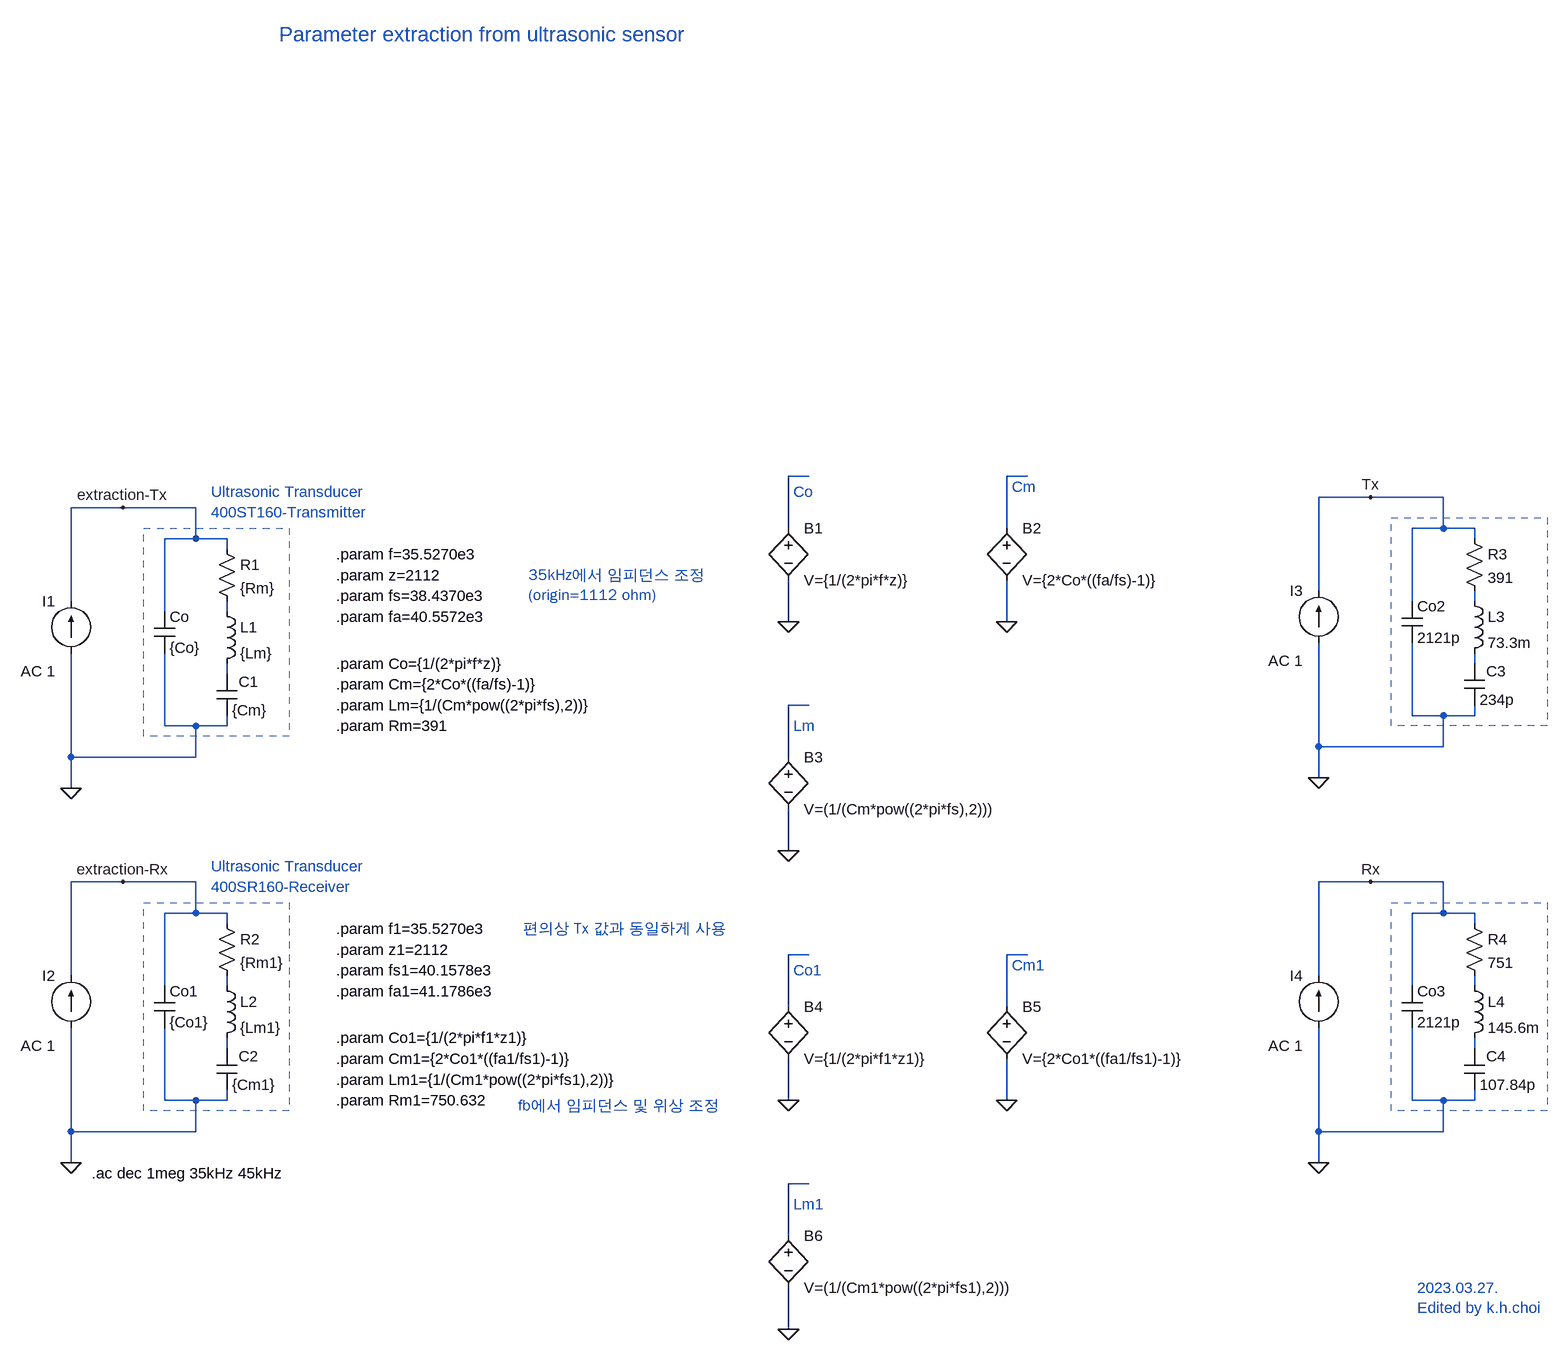
[diagram p0: schematic Parameter extraction from sensor-2.asc]
Parameter extraction from sensor-2.asc, the LTspice schematic file:
Version 4
SHEET 1 2624 1860
WIRE 976 528 944 528
WIRE 1312 528 1280 528
WIRE 1840 560 1760 560
WIRE 1952 560 1840 560
WIRE -80 576 -160 576
WIRE 32 576 -80 576
WIRE 944 608 944 528
WIRE 1280 608 1280 528
WIRE 1952 608 1952 560
WIRE 1952 608 1904 608
WIRE 2000 608 1952 608
WIRE 32 624 32 576
WIRE 32 624 -16 624
WIRE 80 624 32 624
WIRE 2000 624 2000 608
WIRE 80 640 80 624
WIRE 1760 704 1760 560
WIRE -160 720 -160 576
WIRE 1904 720 1904 608
WIRE 2000 720 2000 704
WIRE -16 736 -16 624
WIRE 80 736 80 720
WIRE 944 752 944 688
WIRE 1280 752 1280 688
WIRE 2000 816 2000 800
WIRE 80 832 80 816
WIRE 976 880 944 880
WIRE 1904 896 1904 784
WIRE 1952 896 1904 896
WIRE 2000 896 2000 880
WIRE 2000 896 1952 896
WIRE -16 912 -16 800
WIRE 32 912 -16 912
WIRE 80 912 80 896
WIRE 80 912 32 912
WIRE 1760 944 1760 784
WIRE 1952 944 1952 896
WIRE 1952 944 1760 944
WIRE -160 960 -160 800
WIRE 32 960 32 912
WIRE 32 960 -160 960
WIRE 944 960 944 880
WIRE 1760 992 1760 944
WIRE -160 1008 -160 960
WIRE 944 1104 944 1040
WIRE -80 1152 -160 1152
WIRE 32 1152 -80 1152
WIRE 1840 1152 1760 1152
WIRE 1952 1152 1840 1152
WIRE 32 1200 32 1152
WIRE 32 1200 -16 1200
WIRE 80 1200 32 1200
WIRE 1952 1200 1952 1152
WIRE 1952 1200 1904 1200
WIRE 2000 1200 1952 1200
WIRE 80 1216 80 1200
WIRE 2000 1216 2000 1200
WIRE 976 1264 944 1264
WIRE 1312 1264 1280 1264
WIRE -160 1296 -160 1152
WIRE 1760 1296 1760 1152
WIRE -16 1312 -16 1200
WIRE 80 1312 80 1296
WIRE 1904 1312 1904 1200
WIRE 2000 1312 2000 1296
WIRE 944 1344 944 1264
WIRE 1280 1344 1280 1264
WIRE 80 1408 80 1392
WIRE 2000 1408 2000 1392
WIRE -16 1488 -16 1376
WIRE 32 1488 -16 1488
WIRE 80 1488 80 1472
WIRE 80 1488 32 1488
WIRE 944 1488 944 1424
WIRE 1280 1488 1280 1424
WIRE 1904 1488 1904 1376
WIRE 1952 1488 1904 1488
WIRE 2000 1488 2000 1472
WIRE 2000 1488 1952 1488
WIRE -160 1536 -160 1376
WIRE 32 1536 32 1488
WIRE 32 1536 -160 1536
WIRE 1760 1536 1760 1376
WIRE 1952 1536 1952 1488
WIRE 1952 1536 1760 1536
WIRE -160 1584 -160 1536
WIRE 1760 1584 1760 1536
WIRE 976 1616 944 1616
WIRE 944 1696 944 1616
WIRE 944 1840 944 1776
FLAG -160 1008 0
FLAG 944 752 0
FLAG 1280 752 0
FLAG 944 1104 0
FLAG -80 576 extraction-Tx
FLAG -160 1584 0
FLAG -80 1152 extraction-Rx
FLAG 1760 992 0
FLAG 1840 560 Tx
FLAG 944 1488 0
FLAG 1280 1488 0
FLAG 944 1840 0
FLAG 1760 1584 0
FLAG 1840 1152 Rx
DATAFLAG 944 528 ""
DATAFLAG 1280 528 ""
DATAFLAG 944 880 ""
DATAFLAG 944 1264 ""
DATAFLAG 1280 1264 ""
DATAFLAG 944 1616 ""
SYMBOL res 64 624 R0
SYMATTR InstName R1
SYMATTR Value {Rm}
SYMBOL ind 64 720 R0
SYMATTR InstName L1
SYMATTR Value {Lm}
SYMBOL cap 64 832 R0
WINDOW 0 34 12 Left 2
SYMATTR InstName C1
SYMATTR Value {Cm}
SYMBOL cap -32 736 R0
SYMATTR InstName Co
SYMATTR Value {Co}
SYMBOL current -160 800 R180
WINDOW 0 24 80 Left 2
WINDOW 3 24 0 Left 2
WINDOW 123 24 -28 Left 2
WINDOW 39 0 0 Left 0
SYMATTR InstName I1
SYMATTR Value ""
SYMATTR Value2 AC 1
SYMBOL bv 944 592 R0
SYMATTR InstName B1
SYMATTR Value V={1/(2*pi*f*z)}
SYMBOL bv 1280 592 R0
SYMATTR InstName B2
SYMATTR Value V={2*Co*((fa/fs)-1)}
SYMBOL bv 944 944 R0
SYMATTR InstName B3
SYMATTR Value V=(1/(Cm*pow((2*pi*fs),2)))
SYMBOL res 64 1200 R0
SYMATTR InstName R2
SYMATTR Value {Rm1}
SYMBOL ind 64 1296 R0
SYMATTR InstName L2
SYMATTR Value {Lm1}
SYMBOL cap 64 1408 R0
WINDOW 0 34 12 Left 2
SYMATTR InstName C2
SYMATTR Value {Cm1}
SYMBOL cap -32 1312 R0
SYMATTR InstName Co1
SYMATTR Value {Co1}
SYMBOL current -160 1376 R180
WINDOW 0 24 80 Left 2
WINDOW 3 24 0 Left 2
WINDOW 123 24 -28 Left 2
WINDOW 39 0 0 Left 0
SYMATTR InstName I2
SYMATTR Value ""
SYMATTR Value2 AC 1
SYMBOL res 1984 608 R0
SYMATTR InstName R3
SYMATTR Value 391
SYMBOL ind 1984 704 R0
SYMATTR InstName L3
SYMATTR Value 73.3m
SYMBOL cap 1984 816 R0
WINDOW 0 34 12 Left 2
SYMATTR InstName C3
SYMATTR Value 234p
SYMBOL cap 1888 720 R0
SYMATTR InstName Co2
SYMATTR Value 2121p
SYMBOL current 1760 784 R180
WINDOW 0 24 80 Left 2
WINDOW 3 24 0 Left 2
WINDOW 123 24 -28 Left 2
WINDOW 39 0 0 Left 0
SYMATTR InstName I3
SYMATTR Value ""
SYMATTR Value2 AC 1
SYMBOL bv 944 1328 R0
SYMATTR InstName B4
SYMATTR Value V={1/(2*pi*f1*z1)}
SYMBOL bv 1280 1328 R0
SYMATTR InstName B5
SYMATTR Value V={2*Co1*((fa1/fs1)-1)}
SYMBOL bv 944 1680 R0
SYMATTR InstName B6
SYMATTR Value V=(1/(Cm1*pow((2*pi*fs1),2)))
SYMBOL res 1984 1200 R0
SYMATTR InstName R4
SYMATTR Value 751
SYMBOL ind 1984 1296 R0
SYMATTR InstName L4
SYMATTR Value 145.6m
SYMBOL cap 1984 1408 R0
WINDOW 0 34 12 Left 2
SYMATTR InstName C4
SYMATTR Value 107.84p
SYMBOL cap 1888 1312 R0
SYMATTR InstName Co3
SYMATTR Value 2121p
SYMBOL current 1760 1376 R180
WINDOW 0 24 80 Left 2
WINDOW 3 24 0 Left 2
WINDOW 123 24 -28 Left 2
WINDOW 39 0 0 Left 0
SYMATTR InstName I4
SYMATTR Value ""
SYMATTR Value2 AC 1
TEXT 248 816 Left 2 !.param Co={1/(2*pi*f*z)}
TEXT 248 648 Left 2 !.param f=35.5270e3
TEXT 248 680 Left 2 !.param z=2112
TEXT 248 912 Left 2 !.param Rm=391
TEXT 248 848 Left 2 !.param Cm={2*Co*((fa/fs)-1)}
TEXT 248 712 Left 2 !.param fs=38.4370e3
TEXT 248 744 Left 2 !.param fa=40.5572e3
TEXT 248 880 Left 2 !.param Lm={1/(Cm*pow((2*pi*fs),2))}
TEXT 160 -152 Left 3 ;Parameter extraction from ultrasonic sensor
TEXT 56 552 Left 2 ;Ultrasonic Transducer\n400ST160-Transmitter
TEXT -128 1600 Left 2 !.ac dec 1meg 35kHz 45kHz
TEXT 248 1392 Left 2 !.param Co1={1/(2*pi*f1*z1)}
TEXT 248 1224 Left 2 !.param f1=35.5270e3
TEXT 248 1256 Left 2 !.param z1=2112
TEXT 248 1488 Left 2 !.param Rm1=750.632
TEXT 248 1424 Left 2 !.param Cm1={2*Co1*((fa1/fs1)-1)}
TEXT 248 1288 Left 2 !.param fs1=40.1578e3
TEXT 248 1320 Left 2 !.param fa1=41.1786e3
TEXT 248 1456 Left 2 !.param Lm1={1/(Cm1*pow((2*pi*fs1),2))}
TEXT 56 1128 Left 2 ;Ultrasonic Transducer\n400SR160-Receiver
TEXT 528 1496 Left 2 ;fb에서 임피던스 및 위상 조정
TEXT 544 680 Left 2 ;35kHz에서 임피던스 조정\n(origin=1112 ohm)
TEXT 1288 544 Left 2 ;Cm
TEXT 952 552 Left 2 ;Co
TEXT 952 912 Left 2 ;Lm
TEXT 1288 1280 Left 2 ;Cm1
TEXT 952 1288 Left 2 ;Co1
TEXT 952 1648 Left 2 ;Lm1
TEXT 1912 1776 Left 2 ;2023.03.27.\nEdited by k.h.choi
TEXT 536 1224 Left 2 ;편의상 Tx 값과 동일하게 사용
RECTANGLE Normal 176 928 -48 608 2
RECTANGLE Normal 176 1504 -48 1184 2
RECTANGLE Normal 2112 912 1872 592 2
RECTANGLE Normal 2112 1504 1872 1184 2

The netlist it stands for:
* Parameter extraction from sensor-2.asc
R1 extraction-Tx N004 {Rm}
L1 N004 N006 {Lm}
C1 N006 0 {Cm}
Co extraction-Tx 0 {Co}
I1 0 extraction-Tx AC 1
B1 N001 0 V={1/(2*pi*f*z)}
B2 N002 0 V={2*Co*((fa/fs)-1)}
B3 N007 0 V=(1/(Cm*pow((2*pi*fs),2)))
R2 extraction-Rx N010 {Rm1}
L2 N010 N012 {Lm1}
C2 N012 0 {Cm1}
Co1 extraction-Rx 0 {Co1}
I2 0 extraction-Rx AC 1
R3 Tx N003 391
L3 N003 N005 73.3m
C3 N005 0 234p
Co2 Tx 0 2121p
I3 0 Tx AC 1
B4 N008 0 V={1/(2*pi*f1*z1)}
B5 N009 0 V={2*Co1*((fa1/fs1)-1)}
B6 N014 0 V=(1/(Cm1*pow((2*pi*fs1),2)))
R4 Rx N011 751
L4 N011 N013 145.6m
C4 N013 0 107.84p
Co3 Rx 0 2121p
I4 0 Rx AC 1
.param Co={1/(2*pi*f*z)}
.param f=35.5270e3
.param z=2112
.param Rm=391
.param Cm={2*Co*((fa/fs)-1)}
.param fs=38.4370e3
.param fa=40.5572e3
.param Lm={1/(Cm*pow((2*pi*fs),2))}
* Parameter extraction from ultrasonic sensor
* Ultrasonic Transducer
* 400ST160-Transmitter
.ac dec 1meg 35kHz 45kHz
.param Co1={1/(2*pi*f1*z1)}
.param f1=35.5270e3
.param z1=2112
.param Rm1=750.632
.param Cm1={2*Co1*((fa1/fs1)-1)}
.param fs1=40.1578e3
.param fa1=41.1786e3
.param Lm1={1/(Cm1*pow((2*pi*fs1),2))}
* Ultrasonic Transducer
* 400SR160-Receiver
* fb에서 임피던스 및 위상 조정
* 35kHz에서 임피던스 조정
* (origin=1112 ohm)
* Cm
* Co
* Lm
* Cm1
* Co1
* Lm1
* 2023.03.27.
* Edited by k.h.choi
* 편의상 Tx 값과 동일하게 사용
.backanno
.end